# EAGLE design IHM (EAGLE 9.0.0)
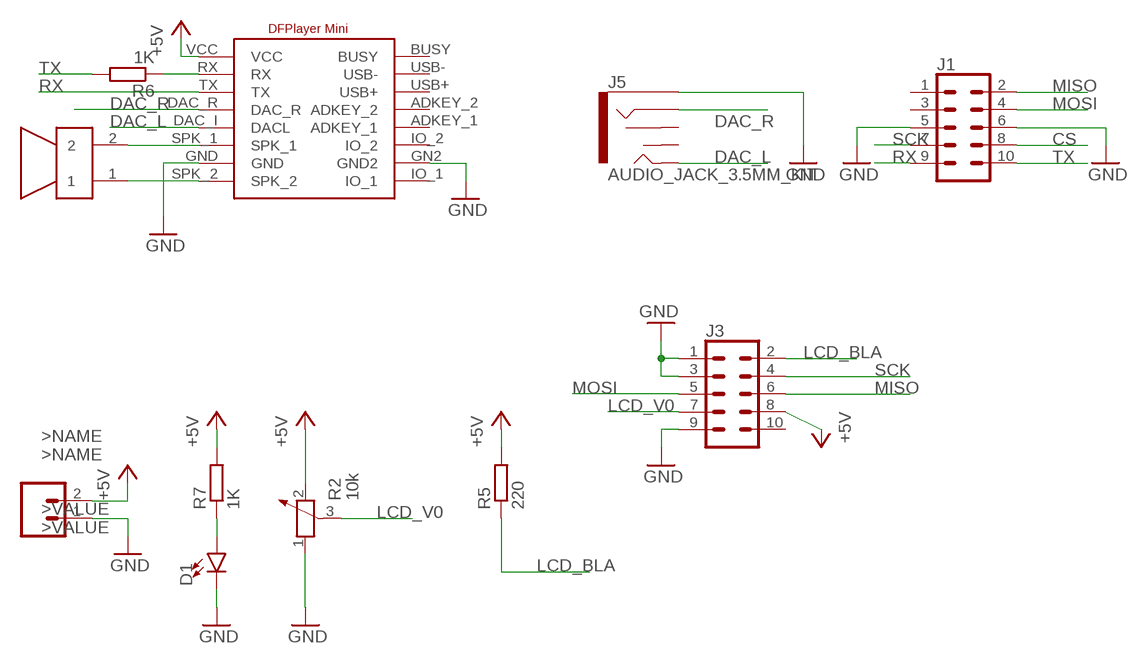
[diagram p0: schematic, sheet 1]

## Parts
D1  LED3MM  [LED_3MM]
J1  CONN_05X2SHD  [2X5-SHROUDED]
J2  CONN_02POLAR  [MOLEX-1X2]
J3  CONN_05X2SHD  [2X5-SHROUDED]
J5  AUDIO_JACK_3.5MM_KIT  [AUDIO-JACK-KIT]
R2  10k  POTENTIOMETER_PT-10  [PT-10]
R5  220  R-EU_0207/10  [0207/10]
R6  1K  R-EU_0207/10  [0207/10]
R7  1K  R-EU_0207/10  [0207/10]
U$1  AST-01508MR-WT-R  [AST-01508MR-WT-R]
U$2  DFPLAYER_MINI  [DFPLAYER_MINI]

## Nets
+5V: J2.2 J3.8 R2.2 R5.2 R7.2 U$2.VCC
CS: J1.8
DAC_L: J5.TIP U$2.DAC_I(DACL)
DAC_R: J5.RING U$2.DAC_R
GND: D1.K(C) J1.5 J1.6 J2.1 J3.1 J3.3 J3.9 J5.SLEEVE R2.1 U$2.GN2(GND2) U$2.GND
LCD_BLA: J3.2 R5.1
LCD_V0: J3.7 R2.3
MISO: J1.2 J3.6
MOSI: J1.4 J3.5
N$1: D1.A R7.1
N$2: U$1.2 U$2.SPK_1
N$3: U$1.1 U$2.SPK_2
N$6: R6.1 U$2.RX
RX: J1.9 U$2.TX
SCK: J1.7 J3.4
TX: J1.10 R6.2
Unconnected: J1.1 J1.3 J3.10 J5.RSH J5.TSH U$2.ADKEY_1 U$2.ADKEY_2 U$2.BUSY U$2.IO_1 U$2.IO_2 U$2.USB+ U$2.USB-

## Library data of the parts
D1 = OPENBOT:LED: LED (Generic) Standard schematic elements and footprints for 5mm, 3mm, 1206, and 0603 sized LEDs. Generic LEDs with no color specified.; PROD_ID: DIO-08794
J1 J3 = OPENBOT:CONN_05X2: Multi connection point. Often used as Generic Header-pin footprint for 0.1 inch spaced/style header connections For AVR SPI programming port, see special device with nice symbol: "AVR_SPI_PROG_5x2.dev" You can populate with any combo of single row headers, but if you'd like an exact match, check these: 2x5 AVR ICSP Male Header <https://www.sparkfun.com/products/778> (PRT-00778) 2x5 Pin Shrouded Header <https://www.sparkfun.com/products/8506> (PRT-08506) On any of the 0.1 inch spaced packages, you can populate with these: Break Away Headers - Straight <https://www.sparkfun.com/products/116> (PRT-00116) Break Away Male Headers - Right Angle <https://www.sparkfun.com/products/553> (PRT-00553) Female Headers <https://www.sparkfun.com/products/115> (PRT-00115) Break Away Headers - Machine Pin <https://www.sparkfun.com/products/117> (PRT-00117) Break Away Female Headers - Swiss Machine Pin <https://www.sparkfun.com/products/743> (PRT-00743) Special note: the shrouded connector mates well with our 5x2 ribbon cables: 2x5 Pin IDC Ribbon Cable <https://www.sparkfun.com/products/8535> (PRT-08535); PROD_ID: CONN-08671; SF_ID: PRT-08506
J2 = OPENBOT:CONN_02: Multi connection point. Often used as Generic Header-pin footprint for 0.1 inch spaced/style header connections On any of the 0.1 inch spaced packages, you can populate with these: Break Away Headers - Straight <https://www.sparkfun.com/products/116> (PRT-00116) Break Away Male Headers - Right Angle <https://www.sparkfun.com/products/553> (PRT-00553) Female Headers <https://www.sparkfun.com/products/115> (PRT-00115) Break Away Headers - Machine Pin <https://www.sparkfun.com/products/117> (PRT-00117) Break Away Female Headers - Swiss Machine Pin <https://www.sparkfun.com/products/743> (PRT-00743) For SCREWTERMINALS and SPRING TERMINALS visit here: Screw Terimnals on SparkFun.com <https://www.sparkfun.com/search/results?term=Screw+Terminals> (5mm/3.5mm/2.54mm spacing) This device is also useful as a general connection point to wire up your design to another part of your project. Our various solder wires solder well into these plated through hole pads. Hook-Up Wire - Assortment (Stranded, 22 AWG) <https://www.sparkfun.com/products/11375> (PRT-11375) Hook-Up Wire - Assortment (Solid Core, 22 AWG) <https://www.sparkfun.com/products/11367> (PRT-11367) View the entire wire category on our website here <https://www.sparkfun.com/categories/141> Special notes: Molex polarized connector foot print use with: PRT-08233 with associated crimp pins and housings. 2.54_SCREWTERM for use with PRT-10571. 3.5mm Screw Terminal footprints for PRT-08084 5mm Screw Terminal footprints for use with PRT-08432 Multi connection point. Often used as Generic Header-pin footprint for 0.1 inch spaced/style header connections On any of the 0.1 inch spaced packages, you can populate with these: Break Away Headers - Straight <https://www.sparkfun.com/products/116> (PRT-00116) Break Away Male Headers - Right Angle <https://www.sparkfun.com/products/553> (PRT-00553) Female Headers <https://www.sparkfun.com/products/115> (PRT-00115) Break Away Headers - Machine Pin <https://www.sparkfun.com/products/117> (PRT-00117) Break Away Female Headers - Swiss Machine Pin <https://www.sparkfun.com/products/743> (PRT-00743) For SCREWTERMINALS and SPRING TERMINALS visit here: Screw Terimnals on SparkFun.com <https://www.sparkfun.com/search/results?term=Screw+Terminals> (5mm/3.5mm/2.54mm spacing) This device is also useful as a general connection point to wire up your design to another part of your project. Our various solder wires solder well into these plated through hole pads. Hook-Up Wire - Assortment (Stranded, 22 AWG) <https://www.sparkfun.com/products/11375> (PRT-11375) Hook-Up Wire - Assortment (Solid Core, 22 AWG) <https://www.sparkfun.com/products/11367> (PRT-11367) View the entire wire category on our website here <https://www.sparkfun.com/categories/141> Special notes: Molex polarized connector foot print use with: PRT-08233 with associated crimp pins and housings. 2.54_SCREWTERM for use with PRT-10571. 3.5mm Screw Terminal footprints for PRT-08084 5mm Screw Terminal footprints for use with PRT-08432; SF_ID: PRT-09918
J5 = SparkFun-Connectors:AUDIO_JACK_3.5MM: Audio Jack 3.5mm variants of PTH and SMT stereo audio jack with bypass switches. SparkFun Products: SparkFun SparkPunk Sound Kit <[https://www.sparkfun.com/products/11177]> - PTH MP3 Trigger <https://www.sparkfun.com/products/13720> -3.5mm SMD SparkFun PicoBoard <https://www.sparkfun.com/products/11888>- 2.5mm SMD; PROD_ID: CONN-08774; SF_ID: PRT-08032
R2 = rcl:POTENTIOMETER_: Potentiometer
R5-R7 = rcl:R-EU_: RESISTOR, European symbol; SPICEPREFIX: R
U$1 = OPENBOT:AST-01508MR-WT-R
U$2 = OPENBOT:DFPLAYER_MINI

## Board
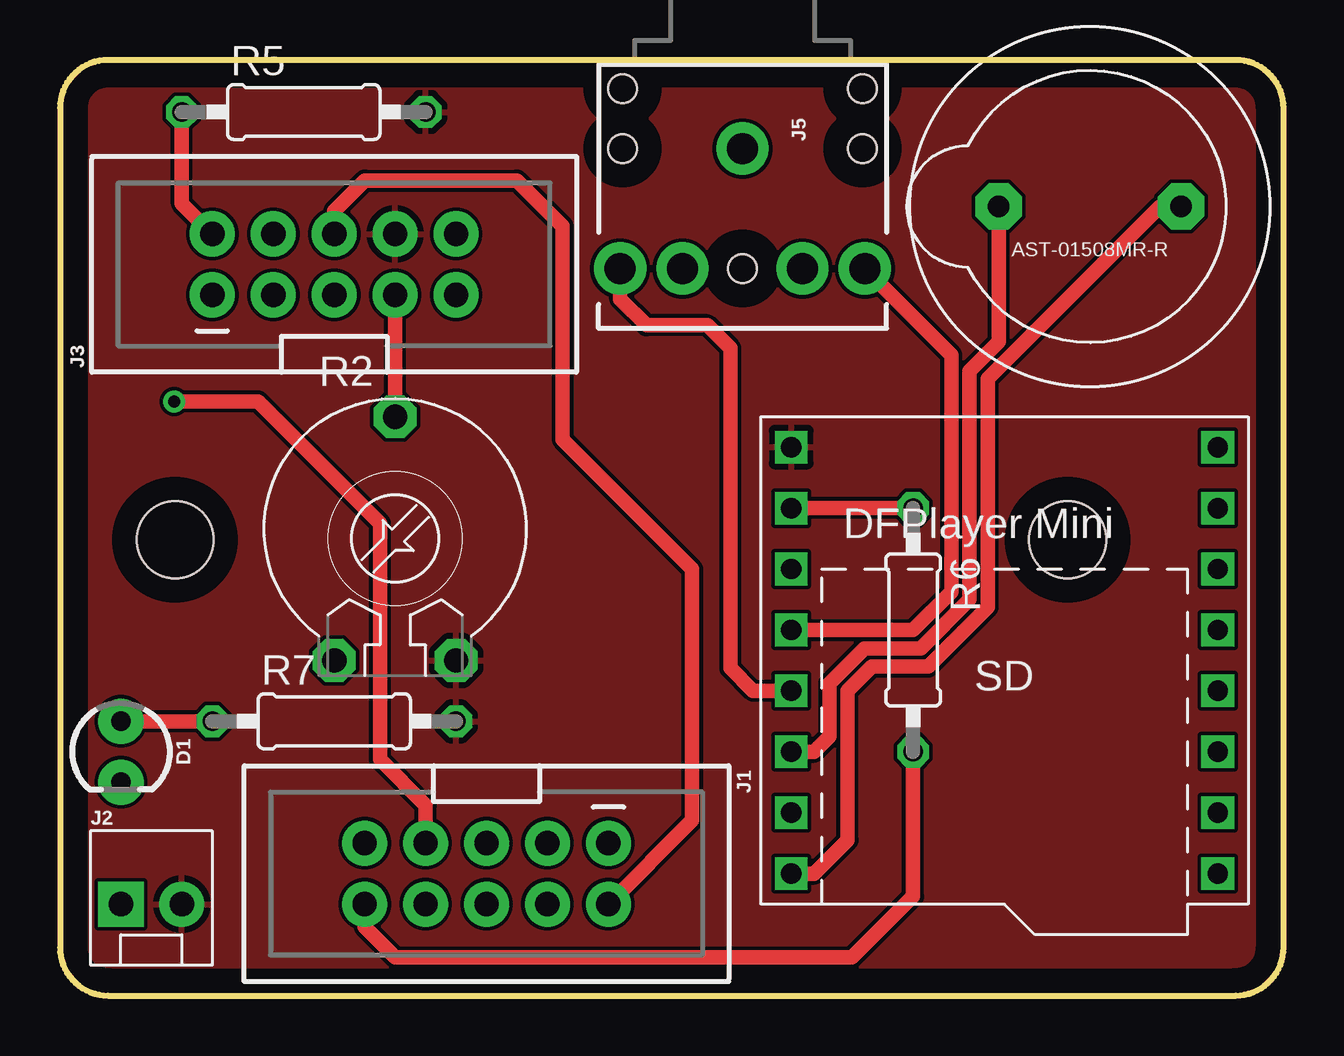
[diagram p1: board, top side]
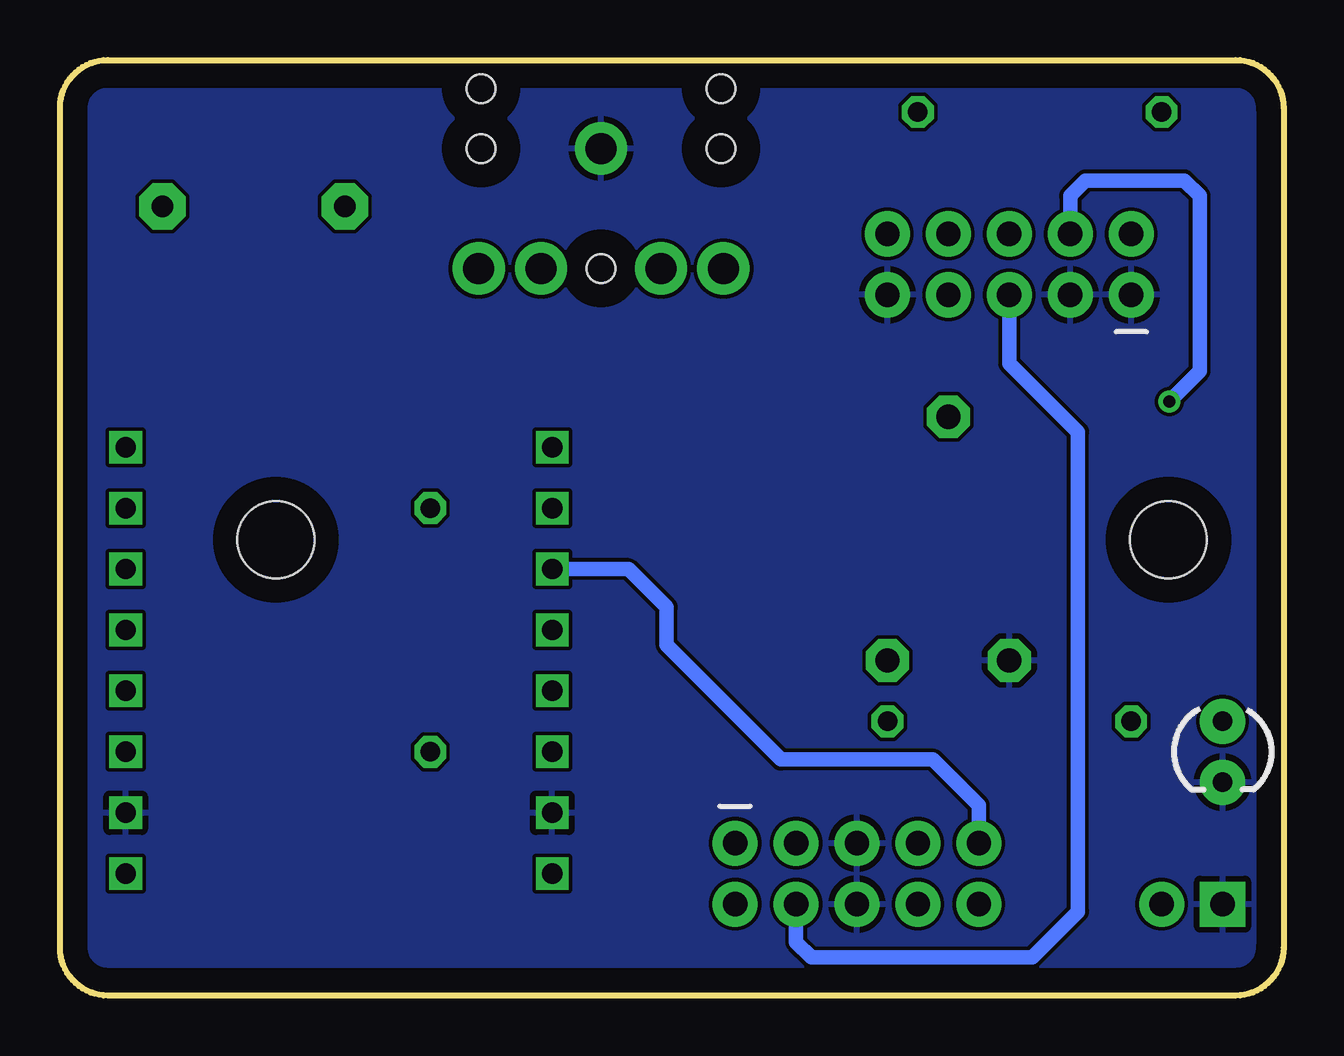
[diagram p2: board, bottom side, seen from below]

Size 51 x 39 mm. Coordinates in mm from the lower left corner, seen from the top.
Outline: 0,2 arc90 2,0 49,0 arc90 51,2 51,37 arc90 49,39 2,39 arc90 0,37 0,2
Copper layers (1*16): Top 0.035mm / dielectric 1.5mm / Bottom 0.035mm
Design rules "default": minimum track width 6mil, minimum drill 0.35mm, track to track 6mil, track to pad 6mil, pad to pad 6mil, via to via 6mil, smd to smd 6mil, copper to edge 40mil, drill to drill 6mil, minimum pad ring 10mil, minimum via ring 8mil, stop-mask expansion 4mil, vias tented up to drill 0mil, thermal gap 10mil
Holes 3.2 mm at 42,19 4.8,19

### Footprints (pad centres in the part's own frame; a part is rotated, then mirrored left to right if it is on the bottom)
LED_3MM = drill 0.813 pad 1.88: A -1.27,0; K 1.27,0
2X5-SHROUDED = drill 1.016 pad 1.88: 1 -1.27,5.08; 2 1.27,5.08; 3 -1.27,2.54; 4 1.27,2.54; 5 -1.27,0; 6 1.27,0; 7 -1.27,-2.54; 8 1.27,-2.54; 9 -1.27,-5.08; 10 1.27,-5.08
MOLEX-1X2 = drill 1.016 pad 1.88 square: 1 0,0 | drill 1.016 pad 1.88: 2 2.54,0
AUDIO-JACK-KIT = drill 1.3 pad 2.184: RING 5,5.1; RSH 5,2.5; SLEEVE 0,0; TIP 5,-5.1; TSH 5,-2.5 | hole 1.2: 0,5; -2.5,5; -2.5,-5; 0,-5; 5,0
PT-10 = drill 1.016 pad 1.778 octagon: 1 -2.54,-5.08; 2 2.54,-5.08; 3 0,5.08
0207/10 = drill 0.813 octagon: 1 -5.08,0; 2 5.08,0
AST-01508MR-WT-R = drill 0.9 pad 1.93 octagon: 1 -3.8,0; 2 3.8,0
DFPLAYER_MINI = drill 0.85 square: ADKEY_1 8.89,-1.27; ADKEY_2 8.89,1.27; BUSY 8.89,8.89; DAC_I -8.89,-1.27; DAC_R -8.89,1.27; GN2 8.89,-6.35; GND -8.89,-6.35; IO_1 8.89,-8.89; IO_2 8.89,-3.81; RX -8.89,6.35; SPK_1 -8.89,-3.81; SPK_2 -8.89,-8.89; TX -8.89,3.81; USB+ 8.89,3.81; USB- 8.89,6.35; VCC -8.89,8.89

### Placement (x,y rotation side)
D1  2.54,10.16 270 top
J1  17.78,5.08 270 top
J2  2.54,3.81 0 top
J3  11.43,30.48 90 top
J5  28.45,35.31 270 top
R2  13.97,19.05 0 top
R5  10.16,36.83 0 top
R6  35.56,15.24 270 top
R7  11.43,11.43 0 top
U$1  42.93,32.89 180 top
U$2  39.37,13.97 0 top

### Tracks (layer width: path | path; a pad name or v marks a point on that pad's centre or on a via)
+5V
  pour Top: 0,39.37 50.8,39.37 50.8,-1.27 0,-1.27
DAC_L
  Top 0.61: U$2.DAC_I 28.89,12.7 27.94,13.65 27.94,26.99 26.99,27.94 24.45,27.94 23.35,29.04 J5.TIP
DAC_R
  Top 0.61: U$2.DAC_R 35.56,15.24 37.15,16.83 37.15,26.71 J5.RING
GND
  pour Bottom: 0,39.37 50.8,39.37 50.8,0 0,0
LCD_BLA
  Top 0.61: J3.2 5.08,33.02 R5.1
LCD_V0
  Top 0.61: R2.3 J3.7
MISO
  Top 0.61: J3.6 11.43,32.7 12.7,33.97 19.05,33.97 20.95,32.07 20.95,23.18 26.35,17.78 26.35,7.3 J1.2
MOSI
  Bottom 0.61: J1.4 20.32,2.22 19.68,1.59 10.48,1.59 8.57,3.49 8.57,23.5 11.43,26.35 J3.5
N$1
  Top 0.61: R7.1 D1.A
N$2
  Top 0.61: U$2.SPK_1 31.43,10.16 32.07,10.79 32.07,13.02 33.53,14.48 35.88,14.48 37.91,16.51 37.91,26.04 39.13,27.25 U$1.2
N$3
  Top 0.61: U$2.SPK_2 31.43,5.08 32.83,6.48 32.83,12.7 33.84,13.72 36.19,13.72 38.67,16.2 38.67,25.72 45.84,32.89 U$1.1
N$6
  Top 0.61: R6.1 U$2.RX
RX
  Bottom 0.61: J1.9 12.7,7.94 14.61,9.84 20.95,9.84 25.72,14.61 25.72,16.19 27.3,17.78 U$2.TX
SCK  (via drill 0.5)
  Top 0.61: J1.7 15.24,7.94 13.34,9.84 13.34,19.68 8.26,24.77 v4.76,24.77
  Bottom 0.61: v4.76,24.77 3.49,26.04 3.49,33.34 4.13,33.97 8.26,33.97 8.89,33.34 J3.4
TX
  Top 0.61: J1.10 12.7,2.86 13.97,1.59 33.02,1.59 35.56,4.13 R6.2